# Altium schematic sheet PowerManagement.SchDoc
size 420 x 297 mm; Dosya adı / File Name: Power Management; Tanım / Description: Wireless Security Detector; Hazırlayan / Prepared By: MFY; Kontrol eden / Checked by: MFY; Onaylayan  /Approved by: MFY; Bölüm / Department: R&D - ARGE; Yayın Tarihi / Rel.date: 11.08.2025; Değ. tarihi / change date: 11.08.2025; Revizyon / Revision: AA; Size: A3
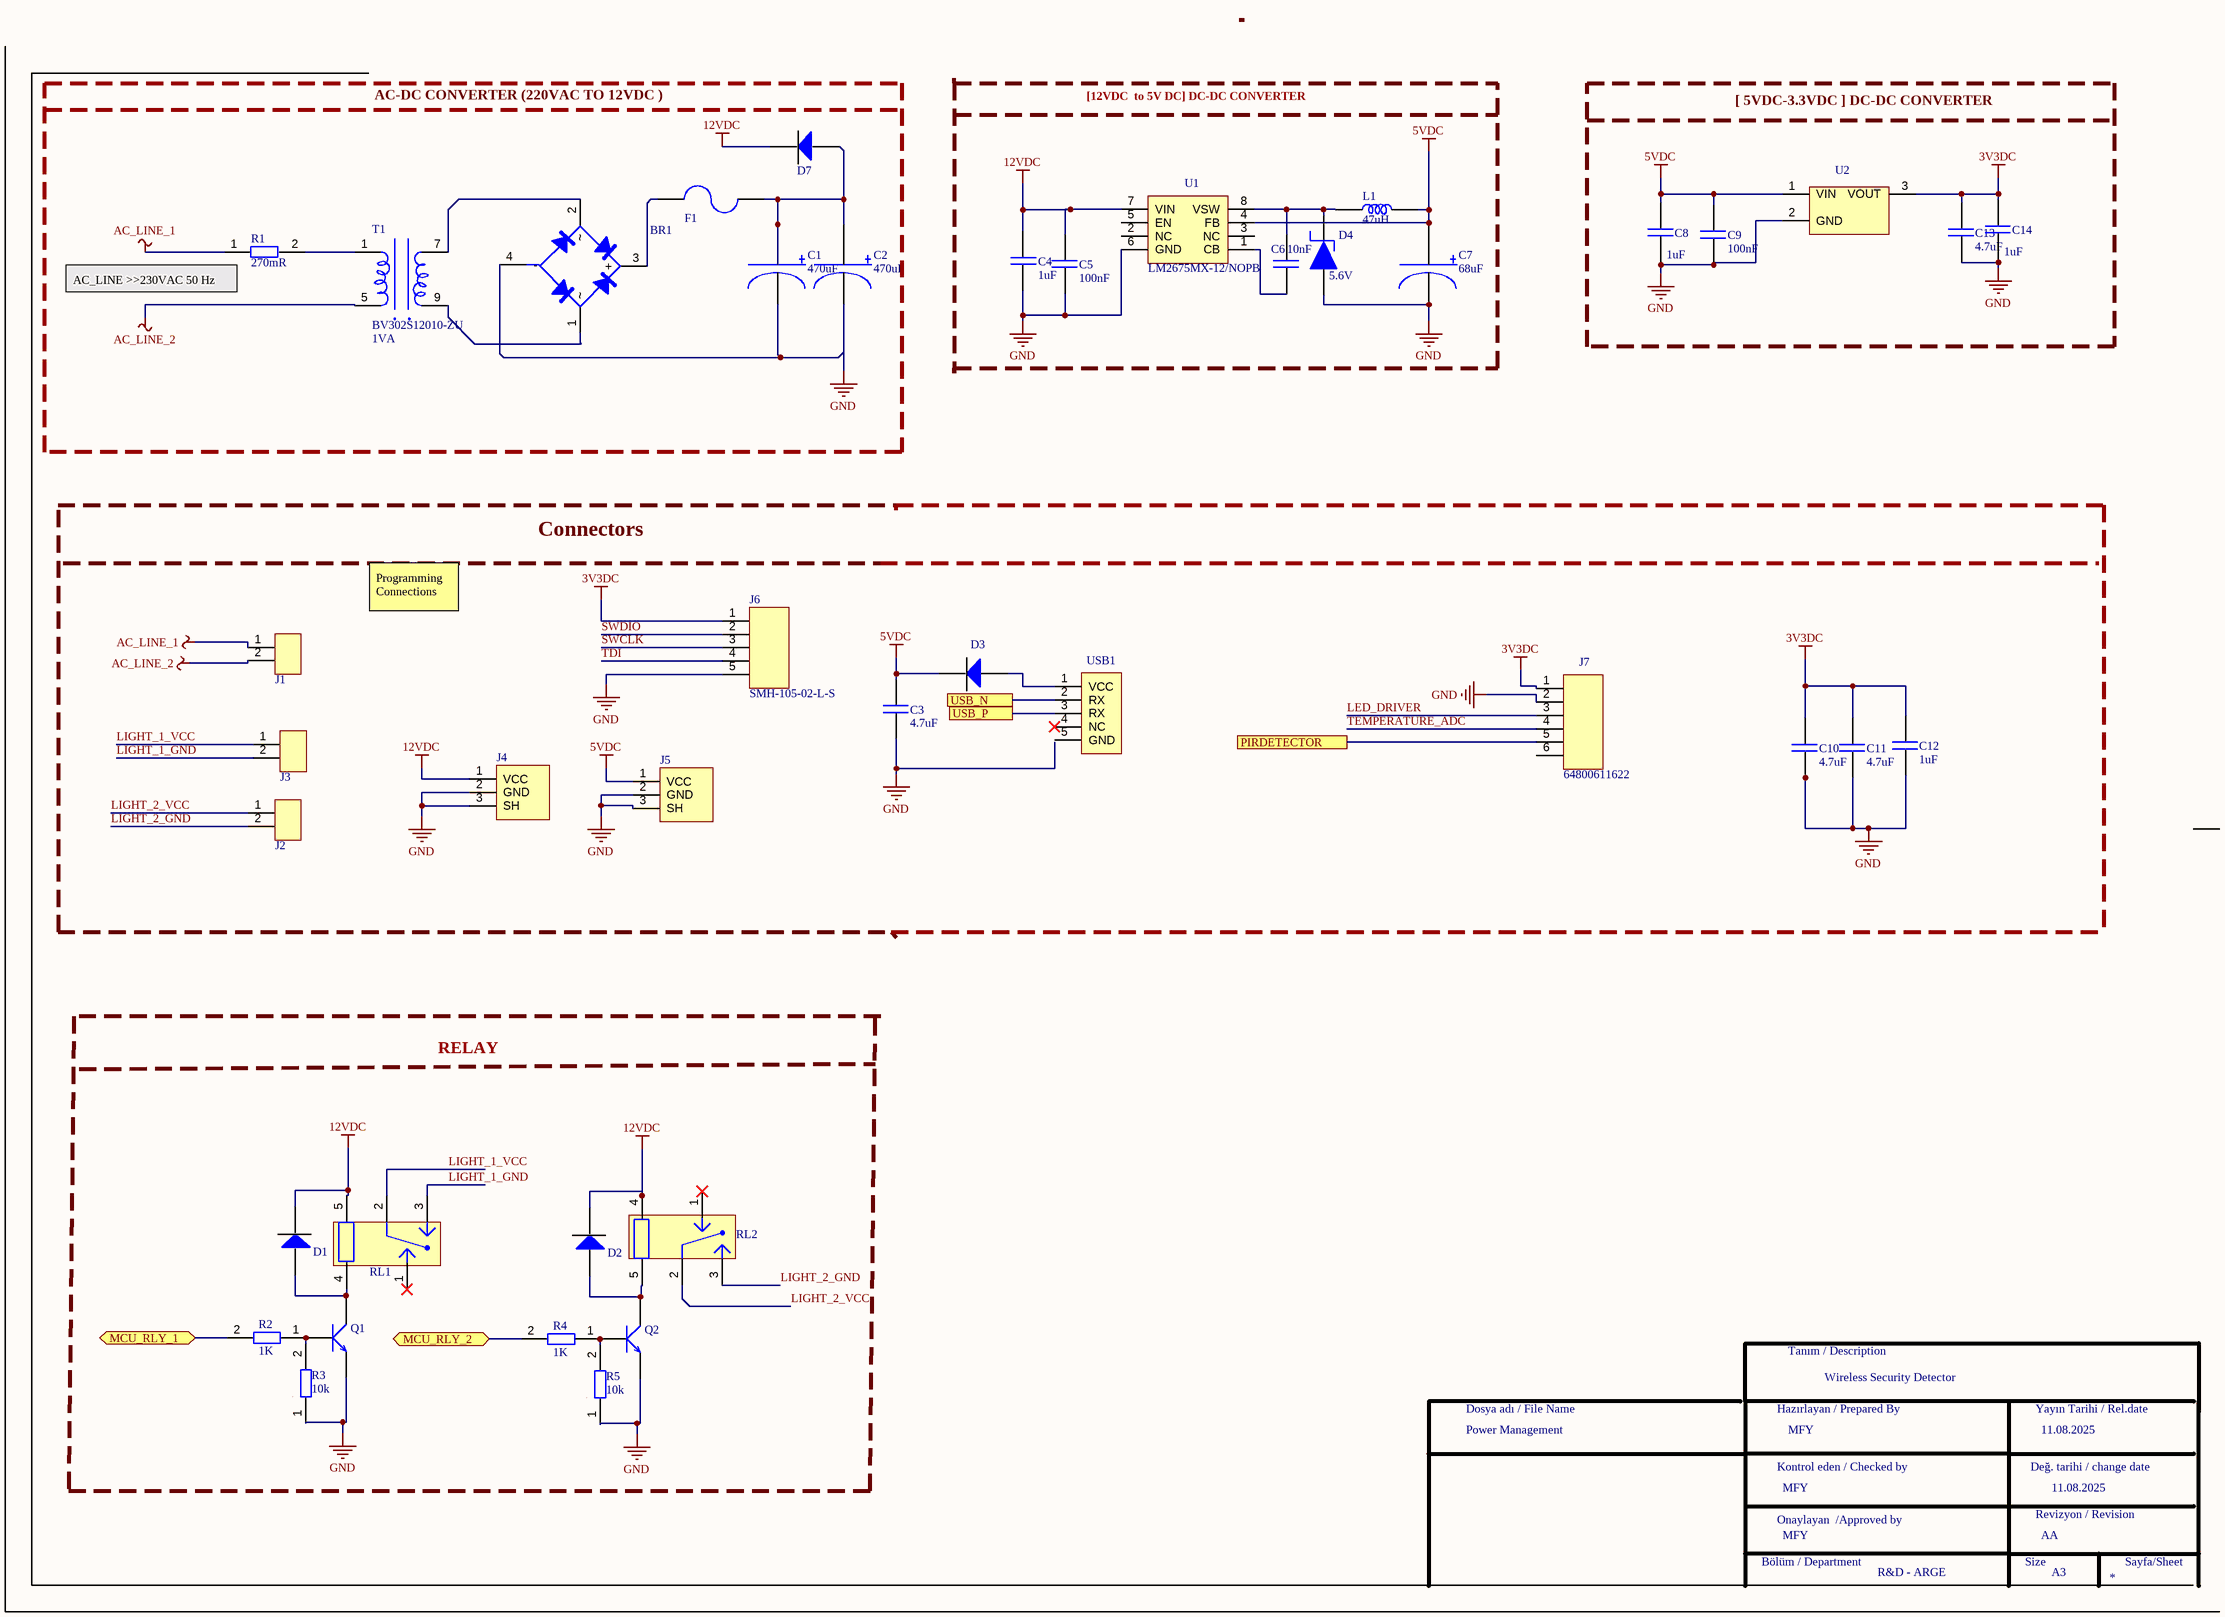
[diagram p0: PowerManagement.SchDoc]

## Parts
BR1  DB105STR  [DB105STR]  (value not drawn)
C1  value 470uF  [CAP_RADIAL_D10_P5]  (hidden comment: ESH477M050AH4AA)
C2  value 470uF  [CAP_RADIAL_D10_P5]  (hidden comment: ESH477M050AH4AA)
C3  value 4.7uF  [CAP_0805]  (hidden comment: CL21A475KAQNNNE)
C4  value 1uF  [CAP_0805]  (hidden comment: CL21B105KBFNNNE)
C5  value 100nF  [CAP_0805]  (hidden comment: CL21B104KBCNNNC)
C6  value 10nF  [CAP_0603]  (hidden comment: 0603B103K160CT)
C7  value 68uF  [CAP_EEVseries]  (hidden comment: EEV686M035A9HAA)
C8  value 1uF  [CAP_0805]  (hidden comment: CL21B105KBFNNNE)
C9  value 100nF  [CAP_0603]  (hidden comment: CAP CER 100nF 0603)
C10  value 4.7uF  [CAP_0805]  (hidden comment: CL21A475KAQNNNE)
C11  value 4.7uF  [CAP_0805]  (hidden comment: CL21A475KAQNNNE)
C12  value 1uF  [CAP_0805]  (hidden comment: CL21B105KBFNNNE)
C13  value 4.7uF  [CAP_0805]  (hidden comment: CL21A475KAQNNNE)
C14  value 1uF  [CAP_0805]  (hidden comment: CL21B105KBFNNNE)
D1  1N4148WS  [SOD323F]  (value not drawn)
D2  1N4148WS  [SOD323F]  (value not drawn)
D3  1N4148WS  [SOD323F]  (value not drawn)
D4  Working Voltage: 5.6V  [SMB]  (hidden comment: 1SMB5919BT3G)
D7  1N4148WS  [SOD323F]  (value not drawn)
F1  FUSE 3413.0216.22  [3413.0216.22]  (value not drawn)
J1  TBP01R1-508-02BE  [TBP01R1-508]  (value not drawn)
J2  TBP01R1-508-02BE  [TBP01R1-508]  (value not drawn)
J3  TBP01R1-508-02BE  [TBP01R1-508]  (value not drawn)
J4  PJ-037AH-SMT-TR  [JACK]  (value not drawn)
J5  PJ-037AH-SMT-TR  [JACK]  (value not drawn)
J6  SMH-105-02-L-S  [PIN_Headers1x5RA]
J7  64800611622  [64800611622_WÜRTH_CONN]
L1  value 47uH  [IND_1212]  (hidden comment: 78438335470)
Q1  MMBT3904-7-F  [SOT23-F]  (value not drawn)
Q2  MMBT3904-7-F  [SOT23-F]  (value not drawn)
R1  value 270mR  [RES_AXIAL_W]  (hidden comment: 5WD27)
R2  value 1K  [RES_0603]  (hidden comment: RES 1K OHM 0603)
R3  value 10k  [RES_0603]  (hidden comment: RC0603FR-0710KL)
R4  value 1K  [RES_0603]  (hidden comment: RES 1K OHM 0603)
R5  value 10k  [RES_0603]  (hidden comment: RC0603FR-0710KL)
RL1  ALQ112  [ALQ112]  (value not drawn)
RL2  ALQ112  [ALQ112]  (value not drawn)
T1  BV302S12010-ZU  Rated Power: 1VA  [BV302S]
U1  LM2675MX-12/NOPB  [SOIC8]
U2  AP7361-33E-13  [SOT-223]  (value not drawn)
USB1  10118192-0001LF  [MICRO_B_USB]  (value not drawn)

## Blocks framed on the sheet
AC-DC CONVERTER (220VAC TO 12VDC ): BR1 C1 C2 D7 F1 R1 T1
[ 5VDC-3.3VDC ] DC-DC CONVERTER: C8 C9 C13 C14 U2

## Ports
MCU_RLY_1 (bidir, see Microcontroller[4C]), MCU_RLY_2 (bidir, see Microcontroller[4C]), PIRDETECTOR (see Microcontroller[4C]), USB_N (see Microcontroller[5B]), USB_P (see Microcontroller[5B])

## Nets
3V3DC: C10.2 C11.2 C12.2 C13.2 C14.2 J6.1 J7.1(VCC) U2.3(VOUT)
5VDC: C3.2 C7.1 C8.2 C9.2 D3.1 J5.1(VCC) L1.2 U1.4(FB) U2.1(VIN)
12VDC: C4.1 C5.2 D1.1 D2.1 D7.1 J4.1(VCC) RL1.5 RL2.4 U1.7(VIN)
AC_LINE_1: J1.1 R1.1
AC_LINE_2: J1.2 T1.5
GND: BR1.4(-) C1.2 C2.2 C3.1 C4.2 C5.1 C7.2 C8.1 C9.1 C10.1 C11.1 C12.1 C13.1 C14.1 D4.A J4.2(GND) J4.3(SH) J5.2(GND) J5.3(SH) J6.5 J7.2(RX) Q1.2(E) Q2.2(E) R3.1 R5.1 U1.6(GND) U2.2(GND)
LED_DRIVER: J7.3(RX)
LIGHT_1_GND: J3.2 RL1.3
LIGHT_1_VCC: J3.1 RL1.2
LIGHT_2_GND: J2.2 RL2.3
LIGHT_2_VCC: J2.1 RL2.2
MCU_RLY_1: R2.2 ; port MCU_RLY_1
MCU_RLY_2: R4.2 ; port MCU_RLY_2
PIRDETECTOR: J7.5(GND) ; port PIRDETECTOR
SWCLK: J6.3
SWDIO: J6.2
TDI: J6.4
TEMPERATURE_ADC: J7.4(NC)
USB_N: USB1.2(RX) ; port USB_N
USB_P: USB1.3(RX) ; port USB_P
NetBR1_1: BR1.1 T1.9
NetBR1_2: BR1.2 T1.7
NetBR1_3: BR1.3(+) F1.1(G)
NetC1_1: C1.1 C2.1 D7.2 F1.2
NetC6_1: C6.1 U1.1(CB)
NetC6_2: C6.2 D4.C L1.1 U1.8(VSW)
NetD1_2: D1.2 Q1.3(C) RL1.4
NetD2_2: D2.2 Q2.3(C) RL2.5
NetD3_2: D3.2 USB1.1(VCC)
NetQ1_1: Q1.1(B) R2.1 R3.2
NetQ2_1: Q2.1(B) R4.1 R5.2
NetR1_2: R1.2 T1.1

Not connected (* = marked no-connect by the designer): J7 6(GND); RL1 1*; RL2 1*; U1 2(NC) 3(NC) 5(EN); USB1 4(NC)* 5(GND)

## Notes on the sheet
- [12VDC  to 5V DC] DC-DC CONVERTER
- (near R1) AC_LINE >>230VAC 50 Hz
- Connectors
- Programming Connections
- RELAY
- Tanım / Description
- Dosya adı / File Name
- Hazırlayan / Prepared By
- Yayın Tarihi / Rel.date
- Kontrol eden / Checked by
- Değ. tarihi / change date
- Bölüm / Department
- Onaylayan  /Approved by
- Size
- Revizyon / Revision
- Sayfa/Sheet

## Library data of the parts
BR1 = DB105STR: Bridge Rect 1PHASE 600V 1A Db-s; Manufacturer: SMC; Supplier: Future Electronics; Supplier Part Number: 5119461; Manufacturer Part Number: DB105STR; RoHS: No; Category: Industrial Control; Pricing: 1500=0,0543, 4500=0,0528, 7500=0,0522, 15000=0,0513, 30000=0,0499 (USD); ComponentLink1URL: http://www.smc-diodes.com/propdf/DB101S%20THRU%20DB107S%20N1459%20REV.B.pdf?src-supplier=Digikey; ComponentLink1Description: http://www.smc-diodes.com/propdf/DB101S%20THRU%20DB107S%20N1459%20REV.B.pdf?src-supplier=Digikey; Operating Voltage: 600V; Max Current: 1A; Case/Package: DB-S
C1 C2 = CAP ALU ELEC 470uF 50V: Aluminum Electrolytic Capacitor, Polarized, Aluminum (wet), 50V, 20% +Tol, 20% -Tol, 470uF, Through Hole Mount; Manufacturer: KEMET; Dielectric Material: Aluminium; Leakage Current: 235uA; Ripple Current: 630mA; Tan Delta: 0.12; Supplier: Mouser; Supplier Part Number: 80-ESH477M050AH4AA; Manufacturer Part Number: ESH477M050AH4AA; RoHS: Yes; Category: Capacitors; Stock: 31; Pricing: 1=0,55, 10=0,338, 50=0,338, 100=0,251, 1000=0,206, 10000=0,174 (USD); Mounting Technology: Through Hole; Pins: 2; Package Shape: Cylindrical; Min Operating Temperature: -40°C; Max Operating Temperature: 105°C; Polarity: Polarized; Capacitor Type: Aluminium; Tolerance  (fill in as +-): 20%; Packaging: Bulk; Tolerance (fill in as +-): 20%; Rated DC Voltage (URdc): 50V; Termination: Wire; Reach SVHC Compliant: Yes; RoHS Compliant: Yes; ComponentLink1URL: https://datasheet.ciiva.com:443/pdfs/VipMasterIC/IC/KEME/KEME-S-A0008512286/KEME-S-A0008512286-1.pdf?src-supplier=IHS+Markit; ComponentLink1Description: https://datasheet.ciiva.com:443/pdfs/VipMasterIC/IC/KEME/KEME-S-A0008512286/KEME-S-A0008512286-1.pdf?src-supplier=IHS+Markit; ComponentLink2URL: https://api.kemet.com/component-edge/download/datasheet/ESH477M050AH4AA.pdf?src-supplier=Digikey; ComponentLink2Description: https://api.kemet.com/component-edge/download/datasheet/ESH477M050AH4AA.pdf?src-supplier=Digikey; ComponentLink3URL: https://datasheet.octopart.com/ESH477M050AH4AA-KEMET-datasheet-130075338.pdf?src-supplier=Newark; ComponentLink3Description: https://datasheet.octopart.com/ESH477M050AH4AA-KEMET-datasheet-130075338.pdf?src-supplier=Newark; ComponentLink4URL: https://datasheet.octopart.com/ESH477M050AH4AA-KEMET-datasheet-157246171.pdf?src-supplier=Element14; ComponentLink4Description: https://datasheet.octopart.com/ESH477M050AH4AA-KEMET-datasheet-157246171.pdf?src-supplier=Element14
C3 C10 C11 C13 = CAP CER 4.7uF 0805: Ceramic Capacitor, Multilayer, Ceramic, 25V, 10% +Tol, 10% -Tol, X5R, 15% TC, 4.7uF, Surface Mount, 0805; Manufacturer: Samsung; Multilayer: Yes; Supplier: Mouser; Supplier Part Number: 187-CL21A475KAQNNNE; Manufacturer Part Number: CL21A475KAQNNNE; RoHS: Yes; Category: Ceramic Capacitors; Stock: 101326; Pricing: 1=0,1, 10=0,039, 50=0,039, 100=0,032, 1000=0,022, 10000=0,012 (USD); Mounting Technology: Surface Mount; Pins: 2; Dielectric Material: Ceramic; Package Shape: Rectangular; Case/Package: 0805; Terminal Finish: Nickel; Min Operating Temperature: -55°C; Max Operating Temperature: 85°C; JESD-609 Code: e3; Capacitor Type: Ceramic; Tolerance  (fill in as +-): 10%; Package Style: SMTMeter; Packaging: Tape and Reel; Tolerance (fill in as +-): 10%; Rated DC Voltage (URdc): 25V; Temperature Characteristics Code: X5R; Termination: Wraparound; Length: 2mm; Width: 1.25mm; Height: 1.4mm; Reach SVHC Compliant: Yes; RoHS Compliant: Yes; ComponentLink1URL: https://datasheet.ciiva.com:443/pdfs/VipMasterIC/IC/SEMS/SEMS-S-A0008528919/SEMS-S-A0008528938-1.pdf?src-supplier=IHS+Markit; ComponentLink1Description: https://datasheet.ciiva.com:443/pdfs/VipMasterIC/IC/SEMS/SEMS-S-A0008528919/SEMS-S-A0008528938-1.pdf?src-supplier=IHS+Markit; ComponentLink2URL: https://datasheet.ciiva.com/25798/cl21a475kaqnnne-25798882.pdf?src-supplier=Digikey; ComponentLink2Description: https://datasheet.ciiva.com/25798/cl21a475kaqnnne-25798882.pdf?src-supplier=Digikey
C4 C8 C12 C14 = CAP CER 1uF 0805: Ceramic Capacitor, Multilayer, Ceramic, 50V, 10% +Tol, 10% -Tol, X7R, 15% TC, 1uF, Surface Mount, 0805; Manufacturer: Samsung; Multilayer: Yes; Supplier: Mouser; Supplier Part Number: 187-CL21B105KBFNNNE; Manufacturer Part Number: CL21B105KBFNNNE; RoHS: Yes; Category: Ceramic Capacitors; Stock: 619004; Pricing: 1=0,1, 10=0,016, 50=0,016, 100=0,013, 1000=0,013, 10000=0,011 (USD); Mounting Technology: Surface Mount; Pins: 2; Dielectric Material: Ceramic; Package Shape: Rectangular; Case/Package: 0805; Terminal Finish: Nickel; Min Operating Temperature: -55°C; Max Operating Temperature: 125°C; JESD-609 Code: e3; Capacitor Type: Ceramic; Tolerance  (fill in as +-): 10%; Package Style: SMTMeter; Packaging: Tape and Reel; Tolerance (fill in as +-): 10%; Rated DC Voltage (URdc): 50V; Temperature Characteristics Code: X7R; Termination: Wraparound; Length: 2mm; Width: 1.25mm; Height: 1.35mm; Reach SVHC Compliant: Yes; RoHS Compliant: Yes; ComponentLink1URL: https://datasheet.ciiva.com:443/pdfs/VipMasterIC/IC/SEMS/SEMS-S-A0008524728/SEMS-S-A0008523023-1.pdf?src-supplier=IHS+Markit; ComponentLink1Description: https://datasheet.ciiva.com:443/pdfs/VipMasterIC/IC/SEMS/SEMS-S-A0008524728/SEMS-S-A0008523023-1.pdf?src-supplier=IHS+Markit; ComponentLink2URL: https://datasheet.ciiva.com/16449/cl21b105kbfnnne-16449003.pdf?src-supplier=Future+Electronics; ComponentLink2Description: https://datasheet.ciiva.com/16449/cl21b105kbfnnne-16449003.pdf?src-supplier=Future+Electronics; ComponentLink3URL: https://datasheet.ciiva.com/25800/cl21b105kbfnnne-25800291.pdf?src-supplier=Digikey; ComponentLink3Description: https://datasheet.ciiva.com/25800/cl21b105kbfnnne-25800291.pdf?src-supplier=Digikey
C5 = CAP CER 100nF 0805: Ceramic Capacitor, Multilayer, Ceramic, 50V, 10% +Tol, 10% -Tol, X7R, 15% TC, 0.1uF, Surface Mount, 0805; Manufacturer: Samsung; Multilayer: Yes; Supplier: Mouser; Supplier Part Number: 187-CL21B104KBCNNNC; Manufacturer Part Number: CL21B104KBCNNNC; RoHS: Yes; Category: Ceramic Capacitors; Stock: 699327; Pricing: 1=0,1, 10=0,006, 50=0,006, 100=0,006, 1000=0,006, 10000=0,005 (USD); Mounting Technology: Surface Mount; Pins: 2; Dielectric Material: Ceramic; Package Shape: Rectangular; Case/Package: 0805; Terminal Finish: Nickel; Min Operating Temperature: -55°C; Max Operating Temperature: 125°C; JESD-609 Code: e3; Capacitor Type: Ceramic; Tolerance  (fill in as +-): 10%; Package Style: SMTMeter; Packaging: Tape and Reel; Tolerance (fill in as +-): 10%; Rated DC Voltage (URdc): 50V; Temperature Characteristics Code: X7R; Termination: Wraparound; Length: 2mm; Width: 1.25mm; Height: 0.95mm; Reach SVHC Compliant: Yes; RoHS Compliant: Yes; ComponentLink1URL: https://datasheet.ciiva.com:443/pdfs/VipMasterIC/IC/SEMS/SEMS-S-A0008521003/SEMS-S-A0008521039-1.pdf?src-supplier=IHS+Markit; ComponentLink1Description: https://datasheet.ciiva.com:443/pdfs/VipMasterIC/IC/SEMS/SEMS-S-A0008521003/SEMS-S-A0008521039-1.pdf?src-supplier=IHS+Markit; ComponentLink2URL: https://datasheet.ciiva.com/25710/cl21b104kbcnnnc-25710182.pdf?src-supplier=Digikey; ComponentLink2Description: https://datasheet.ciiva.com/25710/cl21b104kbcnnnc-25710182.pdf?src-supplier=Digikey; ComponentLink3URL: https://datasheet.ciiva.com/29199/454152-da-01-en-vs-kondensator-0805-29199814.pdf?src-supplier=Conrad; ComponentLink3Description: https://datasheet.ciiva.com/29199/454152-da-01-en-vs-kondensator-0805-29199814.pdf?src-supplier=Conrad
C6 = CAP CER 10nF 0603: Ceramic Capacitor, Multilayer, Ceramic, 16V, 10% +Tol, 10% -Tol, X7R, 15% TC, 0.01uF, Surface Mount, 0603; Manufacturer: Walsin Technologies; Multilayer: Yes; Supplier: Mouser; Supplier Part Number: 791-0603B103K160CT; Manufacturer Part Number: 0603B103K160CT; RoHS: Yes; Category: Ceramic Capacitors; Stock: 5599; Pricing: 1=0,1, 10=0,017, 50=0,017, 100=0,01, 1000=0,006, 10000=0,003 (USD); Mounting Technology: Surface Mount; Pins: 2; Dielectric Material: Ceramic; Case/Package: 0603; Package Shape: Rectangular; Terminal Finish: Nickel; Min Operating Temperature: -55°C; Max Operating Temperature: 125°C; Capacitor Type: Ceramic; Tolerance  (fill in as +-): 10%; Package Style: SMTMeter; Packaging: Tape and Reel; Tolerance (fill in as +-): 10%; Rated DC Voltage (URdc): 16V; Temperature Characteristics Code: X7R; JESD-609 Code: e3; Termination: Wraparound; Length: 1.6mm; Width: 0.8mm; Height: 0.8mm; Reach SVHC Compliant: Yes; RoHS Compliant: Yes; ComponentLink1URL: https://datasheet.ciiva.com:443/pdfs/VipMasterIC/IC/WATC/WATC-S-A0009550342/WATC-S-A0009550342-1.pdf?src-supplier=IHS+Markit; ComponentLink1Description: https://datasheet.ciiva.com:443/pdfs/VipMasterIC/IC/WATC/WATC-S-A0009550342/WATC-S-A0009550342-1.pdf?src-supplier=IHS+Markit; ComponentLink2URL: http://www.farnell.com/datasheets/1958513.pdf?src-supplier=Farnell; ComponentLink2Description: http://www.farnell.com/datasheets/1958513.pdf?src-supplier=Farnell; ComponentLink3URL: https://datasheet.octopart.com/0603B103K160CT-Walsin-Technologies-datasheet-85392065.pdf?src-supplier=Element14; ComponentLink3Description: https://datasheet.octopart.com/0603B103K160CT-Walsin-Technologies-datasheet-85392065.pdf?src-supplier=Element14; ComponentLink4URL: http://www.passivecomponent.com/wp-content/uploads/2018/10/MLCC.pdf?src-supplier=Digikey; ComponentLink4Description: http://www.passivecomponent.com/wp-content/uploads/2018/10/MLCC.pdf?src-supplier=Digikey; ComponentLink5URL: https://datasheet.octopart.com/0603B103K160CT-Walsin-Technologies-datasheet-136037192.pdf?src-supplier=Future+Electronics; ComponentLink5Description: https://datasheet.octopart.com/0603B103K160CT-Walsin-Technologies-datasheet-136037192.pdf?src-supplier=Future+Electronics; ComponentLink6URL: https://datasheet.octopart.com/0603B103K160CT-Walsin-Technologies-datasheet-62066062.pdf?src-supplier=TME; ComponentLink6Description: https://datasheet.octopart.com/0603B103K160CT-Walsin-Technologies-datasheet-62066062.pdf?src-supplier=TME
C7 = CAP ALU 68uF: Aluminum Electrolytic Capacitor, Polarized, Aluminum (wet), 35V, 20% +Tol, 20% -Tol, 68uF, Surface Mount, 2626; Manufacturer: KEMET; Dielectric Material: Aluminium; ESR (Equivalent Series Resistance): 340mR; Leakage Current: 23.8uA; Ripple Current: 196mA; Tan Delta: 0.12; Supplier: Mouser; Supplier Part Number: 80-EEV686M035A9HAA; Manufacturer Part Number: EEV686M035A9HAA; RoHS: Yes; Category: Aluminum Electrolytic Capacitors; Stock: 1319; Pricing: 1=0,63, 10=0,35, 50=0,35, 100=0,266, 1000=0,166, 10000=0,166 (USD); Mounting Technology: Surface Mount; Pins: 2; Package Shape: Cylindrical; Case/Package: 2626; Min Operating Temperature: -55°C; Max Operating Temperature: 105°C; Polarity: Polarized; Capacitor Type: Aluminium; Tolerance  (fill in as +-): 20%; Package Style: SMTMeter; Packaging: Tape and Reel; Tolerance (fill in as +-): 20%; Rated DC Voltage (URdc): 35V; Termination: Flat; Length: 7.8mm; Width: 6.6mm; Height: 7.7mm; Reach SVHC Compliant: Yes; RoHS Compliant: Yes; ComponentLink1URL: https://datasheet.ciiva.com:443/pdfs/VipMasterIC/IC/KEME/KEME-S-A0008611149/KEME-S-A0008611149-1.pdf?src-supplier=IHS+Markit; ComponentLink1Description: https://datasheet.ciiva.com:443/pdfs/VipMasterIC/IC/KEME/KEME-S-A0008611149/KEME-S-A0008611149-1.pdf?src-supplier=IHS+Markit; ComponentLink2URL: https://datasheet.ciiva.com/5365/kem-a4002-eev-535332-5365784.pdf?src-supplier=Mouser; ComponentLink2Description: https://datasheet.ciiva.com/5365/kem-a4002-eev-535332-5365784.pdf?src-supplier=Mouser
C9 = CAP CER 100nF 0603: CAP CER %10 100 nF 0603 Kemet; Manufacturer Part Number: C0603C104K5RACTU; Dielectric Material: Ceramic; Multilayer: Yes; Tolerance  (fill in as +-): 10%; Rated DC Voltage (URdc): 50V; Temperature Characteristics Code: X7R; Supplier: Mouser; Supplier Part Number: 80-C0603C104K5R; Manufacturer: KEMET; RoHS: Yes; Category: Ceramic Capacitors; Stock: 2298151; Pricing: 1=0,1, 10=0,012, 50=0,012, 100=0,011, 1000=0,011, 10000=0,01 (USD); Mounting Technology: Surface Mount; Pins: 2; Package Shape: Rectangular; Case/Package: 0603; Terminal Finish: Nickel; Min Operating Temperature: -55°C; Max Operating Temperature: 125°C; JESD-609 Code: e3; Capacitor Type: Ceramic; Package Style: SMTMeter; Packaging: Tape and Reel; Tolerance (fill in as +-): 10%; Termination: Wraparound; Length: 1.6mm; Width: 0.8mm; Height: 0.8mm; Reach SVHC Compliant: Yes; RoHS Compliant: Yes; ComponentLink1URL: https://datasheet.ciiva.com:443/pdfs/VipMasterIC/IC/KEME/KEME-S-A0008991654/KEME-S-A0008991654-1.pdf?src-supplier=IHS+Markit; ComponentLink1Description: https://datasheet.ciiva.com:443/pdfs/VipMasterIC/IC/KEME/KEME-S-A0008991654/KEME-S-A0008991654-1.pdf?src-supplier=IHS+Markit; ComponentLink2URL: https://datasheet.ciiva.com/7823/kem-c1002-x7r-smd-7823592.pdf?src-supplier=Element14; ComponentLink2Description: https://datasheet.ciiva.com/7823/kem-c1002-x7r-smd-7823592.pdf?src-supplier=Element14; ComponentLink3URL: https://datasheet.ciiva.com/28645/1851736-28645640.pdf?src-supplier=Element14; ComponentLink3Description: https://datasheet.ciiva.com/28645/1851736-28645640.pdf?src-supplier=Element14; ComponentLink4URL: https://datasheet.ciiva.com/14602/70095383-14602583.pdf?src-supplier=Allied+Electronics; ComponentLink4Description: https://datasheet.ciiva.com/14602/70095383-14602583.pdf?src-supplier=Allied+Electronics; ComponentLink5URL: https://datasheet.ciiva.com/7823/kem-c1002-x7r-smd-7823591.pdf?src-supplier=Element14; ComponentLink5Description: https://datasheet.ciiva.com/7823/kem-c1002-x7r-smd-7823591.pdf?src-supplier=Element14; ComponentLink6URL: https://datasheet.ciiva.com/5999/kem-c1002-x7r-smd-5999400.pdf?src-supplier=Farnell; ComponentLink6Description: https://datasheet.ciiva.com/5999/kem-c1002-x7r-smd-5999400.pdf?src-supplier=Farnell; ComponentLink7URL: https://datasheet.ciiva.com/14585/70095383-14585209.pdf?src-supplier=Allied+Electronics; ComponentLink7Description: https://datasheet.ciiva.com/14585/70095383-14585209.pdf?src-supplier=Allied+Electronics
D1-D3 D7 = 1N4148WS: Rectifier Diode, 1 Phase, 1 Element, 0.15A, 100V V(RRM), Silicon; Manufacturer: onsemi; Package Body Material: Plastic; Number of Elements: 1; Max Output current: 150mA; Reverse Recovery Time-Max: 0.004us; Qualification Status: Not Qualified; Forward Voltage: 1V; Supplier: Mouser; Supplier Part Number: 512-1N4148WS; Manufacturer Part Number: 1N4148WS; RoHS: Yes; Category: Rectifier Diodes; Stock: 898084; Pricing: 1=0,11, 10=0,066, 50=0,066, 100=0,062, 1000=0,041, 10000=0,019 (USD); Pins: 2; Diode Element Material: SILICON; Package Shape: Rectangular; Max Operating Temperature: 150°C; Diode Type: RECTIFIER; JESD-30 Code: R-PDSO-F2; Package Style: SMALL OUTLINEMeter; Rep Pk Reverse Voltage-Max: 100V; Surface Mount: Yes; Terminal Form: Flat; Terminal Position: DUAL; Moisture Sensitivity Level: 1; Reach SVHC Compliant: Yes; RoHS Compliant: Yes; ComponentLink1URL: https://datasheet.ciiva.com:443/pdfs/VipMasterIC/IC/ONSM/ONSM-S-A0003392874/ONSM-S-A0003585195-1.pdf?src-supplier=IHS+Markit; ComponentLink1Description: https://datasheet.ciiva.com:443/pdfs/VipMasterIC/IC/ONSM/ONSM-S-A0003392874/ONSM-S-A0003585195-1.pdf?src-supplier=IHS+Markit
D4 = 1SMB5919BT3G: Zener Diode 5.6 V 3 W ±5% Surface Mount SMB; DESINED BY: MFY
F1 = FUSE 3413.0216.22: Electric Fuse, Very Fast Blow, 1A, 32VAC, 63VDC, 63A (IR), Surface Mount, 1206; Manufacturer: Schurter; Joule-integral-Nom: 0.2J; Pre-arcing time-Min: 1ms; Voltage Rating: 32V; Body Breadth: 1.6mm; Body Height: 0.6mm; Body Length or Diameter: 3.2mm; Reference Standard: UL; Supplier: Mouser; Supplier Part Number: 693-3413.0216.22; Manufacturer Part Number: 3413.0216.22; RoHS: Yes; Category: Fuses; Stock: 2978; Pricing: 1=0,56, 10=0,558, 50=0,448, 100=0,413, 1000=0,412, 10000=0,386 (USD); Mounting Technology: Surface Mount; Terminal Finish: Nickel; Min Operating Temperature: -55°C; Max Operating Temperature: 90°C; JESD-609 Code: e4; Blow Characteristic: VERY FAST; Circuit Protection Type: Electric Fuse; Packaging: Tape and Reel; Rated Breaking Capacity: 63A; Current Rating: 1A; Termination: Wraparound; Reach SVHC Compliant: Yes; RoHS Compliant: Yes; ComponentLink1URL: https://datasheet.ciiva.com:443/pdfs/VipMasterIC/IC/SHRI/SHRI-S-A0004985783/SHRI-S-A0004985783-1.pdf?src-supplier=IHS+Markit; ComponentLink1Description: https://datasheet.ciiva.com:443/pdfs/VipMasterIC/IC/SHRI/SHRI-S-A0004985783/SHRI-S-A0004985783-1.pdf?src-supplier=IHS+Markit; ComponentLink2URL: https://datasheet.ciiva.com/301/typ-usi-1206-301440.pdf?src-supplier=Digikey; ComponentLink2Description: https://datasheet.ciiva.com/301/typ-usi-1206-301440.pdf?src-supplier=Digikey; ComponentLink3URL: https://datasheet.ciiva.com/14102/qousi1206-data-e-14102903.pdf?src-supplier=Distrelec; ComponentLink3Description: https://datasheet.ciiva.com/14102/qousi1206-data-e-14102903.pdf?src-supplier=Distrelec; ComponentLink4URL: https://datasheet.ciiva.com/8264/typ-usi-1206-8264583.pdf?src-supplier=Avnet; ComponentLink4Description: https://datasheet.ciiva.com/8264/typ-usi-1206-8264583.pdf?src-supplier=Avnet; ComponentLink5URL: https://datasheet.ciiva.com/16316/typ-usi-1206-16316588.pdf?src-supplier=Future+Electronics; ComponentLink5Description: https://datasheet.ciiva.com/16316/typ-usi-1206-16316588.pdf?src-supplier=Future+Electronics; ComponentLink6URL: https://datasheet.ciiva.com/301/typ-usi-1206-301439.pdf?src-supplier=Digikey; ComponentLink6Description: https://datasheet.ciiva.com/301/typ-usi-1206-301439.pdf?src-supplier=Digikey; ComponentLink7URL: https://datasheet.ciiva.com/301/typ-usi-1206-301441.pdf?src-supplier=Digikey; ComponentLink7Description: https://datasheet.ciiva.com/301/typ-usi-1206-301441.pdf?src-supplier=Digikey; ComponentLink8URL: https://datasheet.ciiva.com/14541/70160006-14541114.pdf?src-supplier=Allied+Electronics; ComponentLink8Description: https://datasheet.ciiva.com/14541/70160006-14541114.pdf?src-supplier=Allied+Electronics
J1-J3 = TBP01R1-508-02BE: Strip Terminal Block; Manufacturer: Same Sky; DESIGNED BY: MFY; Supplier: Arrow Electronics; Supplier Part Number: TBP01R1-508-02BE; Manufacturer Part Number: TBP01R1-508-02BE; RoHS: Yes; Category: Terminal Blocks; Stock: 3065; Pricing: 1=0,0786 (USD); ComponentLink1URL: https://www.cuidevices.com/product/resource/digikeypdf/tbp01r1-508.pdf?src-supplier=Digikey; ComponentLink1Description: https://www.cuidevices.com/product/resource/digikeypdf/tbp01r1-508.pdf?src-supplier=Digikey; ComponentLink2URL: https://datasheet.octopart.com/TBP01R1-508-02BE-Same-Sky-datasheet-182050293.pdf?src-supplier=Future+Electronics; ComponentLink2Description: https://datasheet.octopart.com/TBP01R1-508-02BE-Same-Sky-datasheet-182050293.pdf?src-supplier=Future+Electronics; ComponentLink3URL: https://datasheet.octopart.com/TBP01R1-508-02BE-Same-Sky-datasheet-182881516.pdf?src-supplier=Electro+Sonic; ComponentLink3Description: https://datasheet.octopart.com/TBP01R1-508-02BE-Same-Sky-datasheet-182881516.pdf?src-supplier=Electro+Sonic; ComponentLink4URL: https://datasheet.octopart.com/TBP01R1-508-02BE-Same-Sky-datasheet-189105742.pdf?src-supplier=Master+Electronics; ComponentLink4Description: https://datasheet.octopart.com/TBP01R1-508-02BE-Same-Sky-datasheet-189105742.pdf?src-supplier=Master+Electronics
J4 J5 = PJ-037AH-SMT-TR: Power Barrel Connector Jack 2.10mm ID (0.083"), 5.50mm OD (0.217") Surface Mount, Right Angle; Through Hole; DESIGNED BY: MFY
J6 = SMH-105-02-L-S: Board Connector, 5 Contact(s), 1 Row(s), Female, Right Angle, 0.1 inch Pitch, Surface Mount Terminal, Locking, Black Insulator, Socket; Manufacturer: Samtec; Contact Pattern: RECTANGULAR; Contact Style: SQ PIN-SKT; Number Of Connectors: 1; Polarization Key: POLARIZED HOUSING; Number of Contacts: 5; Option: General Purpose; Filter Feature: No; Mating Information: MULTIPLE MATING PARTS AVAILABLE; Body Breadth: 0.095inch; Body Depth: 0.47inch; Body Length: 0.52inch; Plating Thickness: 10uin; Reference Standard: UL; Reliability: COMMERCIAL; Supplier: Mouser; Supplier Part Number: 200-SMH10502LS; Manufacturer Part Number: SMH-105-02-L-S; RoHS: Yes; Category: Connectors; Stock: 103; Pricing: 1=2,05, 10=2,05, 50=2,05, 100=1,59, 1000=1,09, 10000=0,669 (USD); Mounting Technology: Board; Contact Material: Bronze; Contact Finish - Termination: Tin (Sn) - with Nickel (Ni) barrier; Contact Finish - Mating: GOLD (10) OVER NICKEL (50); Insulation Color: Black; Insulation Material: Polymer; Connector Type: BOARD CONNECTOR; JESD-609 Code: e3; Contact Gender: Female; Mounting Style: RIGHT ANGLE; Number Of PCB Rows: 1; Number of Rows Loaded: 1; PCB Contact Pattern: RECTANGULAR; Termination: SMD/SMT; Body/Shell Style: SOCKET; Mixed Contacts: No; Mating Contact Pitch: 0.1inch; Mounting Option 1: LOCKING; Terminal Pitch: 2.54mm; Reach SVHC Compliant: Yes; RoHS Compliant: Yes; DIN Conformance: No; IEC Conformance: No; MIL Conformance: No; ComponentLink1URL: https://datasheet.ciiva.com:443/pdfs/VipMasterIC/IC/SAMI/SAMI-S-A0002821944/SAMI-S-A0002821944-1.pdf?src-supplier=IHS+Markit; ComponentLink1Description: https://datasheet.ciiva.com:443/pdfs/VipMasterIC/IC/SAMI/SAMI-S-A0002821944/SAMI-S-A0002821944-1.pdf?src-supplier=IHS+Markit; ComponentLink2URL: http://www.farnell.com/datasheets/1927708.pdf?_ga=2.237598468.569325269.1503285096-1413671594.1503025027&src-supplier=Farnell; ComponentLink2Description: http://www.farnell.com/datasheets/1927708.pdf?_ga=2.237598468.569325269.1503285096-1413671594.1503025027&src-supplier=Farnell; ComponentLink3URL: http://www.samtec.com/documents/webfiles/pdf/SMH.PDF?src-supplier=Newark; ComponentLink3Description: http://www.samtec.com/documents/webfiles/pdf/SMH.PDF?src-supplier=Newark; ComponentLink4URL: http://www.samtec.com/documents/webfiles/pdf/SMH.PDF?src-supplier=Avnet; ComponentLink4Description: http://www.samtec.com/documents/webfiles/pdf/SMH.PDF?src-supplier=Avnet; ComponentLink5URL: http://suddendocs.samtec.com/catalog_english/smh.pdf?src-supplier=Digikey; ComponentLink5Description: http://suddendocs.samtec.com/catalog_english/smh.pdf?src-supplier=Digikey
J7 = 64800611622_CONN_6PIN: WR-WTB Wire-to-Board Connectors 1.50 mm(ANA KARTTAN SENSOR KARTA); Manufacturer: Wurth Electronics; Supplier: Farnell; Supplier Part Number: 3818179; Manufacturer Part Number: 64800611622; RoHS: No; Category: Uncategorized; Stock: 148; Pricing: 10=0,375, 100=0,297, 500=0,262, 1000=0,257, 2500=0,252 (EUR)
L1 = IND 47uH: General Purpose Inductor, 47uH, 20%, 1 Element, Iron Alloy-Core, SMD, 1212; Manufacturer: Wurth Electronics; Supplier: Mouser; Supplier Part Number: 710-78438335470; Manufacturer Part Number: 78438335470; RoHS: Yes; Category: Fixed Inductors; Stock: 844; Pricing: 1=1,9, 10=1,9, 50=1,78, 100=1,78, 1000=1,39, 10000=1,23 (USD); Inductor Type: GENERAL PURPOSE INDUCTOR; Reach SVHC Compliant: Yes; RoHS Compliant: No; ComponentLink1URL: https://datasheet.ciiva.com:443/pdfs/VipMasterIC/IC/MIDC/MIDC-S-A0004708317/MIDC-S-A0004708317-1.pdf?src-supplier=IHS+Markit; ComponentLink1Description: https://datasheet.ciiva.com:443/pdfs/VipMasterIC/IC/MIDC/MIDC-S-A0004708317/MIDC-S-A0004708317-1.pdf?src-supplier=IHS+Markit; ComponentLink2URL: https://media.digikey.com/pdf/Data%20Sheets/Wurth%20Electronics%20PDFs/Q+_Products_Flyer.pdf?src-supplier=Digikey; ComponentLink2Description: https://media.digikey.com/pdf/Data%20Sheets/Wurth%20Electronics%20PDFs/Q+_Products_Flyer.pdf?src-supplier=Digikey
Q1 Q2 = MMBT3904-7-F: Small Signal Bipolar Transistor, 0.2A I(C), 40V V(BR)CEO, 1-Element, NPN, Silicon SOT-23F (DAHA ÖNCEDEN footprinti VARDI).; Manufacturer: Diodes Zetex; Package Body Material: Plastic; Additional Feature: HIGH RELIABILITY; Max Collector Current: 200mA; DC Current Gain-Min (hFE): 30; Number of Elements: 1; Power Dissipation-Max (Abs): 300mW; Time @ Peak Reflow Temperature-Max (s): 40s; Transistor Application: SWITCHING; Frequency: 300MHz; Turn-off Time-Max (toff): 250ns; Turn-on Time-Max (ton): 70ns; Qualification Status: Not Qualified; DESIGNED BY: MFY; Supplier: Mouser; Supplier Part Number: 621-MMBT3904-F; Manufacturer Part Number: MMBT3904-7-F; RoHS: Yes; Category: BJTs; Stock: 1405536; Pricing: 1=0,11, 10=0,052, 50=0,052, 100=0,036, 1000=0,025, 10000=0,016 (USD); Pins: 3; Package Shape: Rectangular; Terminal Finish: Tin; Transistor Element Material: SILICON; Max Operating Temperature: 150°C; JESD-609 Code: e3; Polarity/Channel Type: NPN; Collector-emitter Voltage-Max: 40V; JESD-30 Code: R-PDSO-G3; Moisture Sensitivity Level: 1; Package Style: SMALL OUTLINEMeter; Peak Reflow Temperature (Cel): 260°C; Surface Mount: Yes; Terminal Form: Gull Wing; Terminal Position: DUAL; Reach SVHC Compliant: Yes; RoHS Compliant: Yes; ComponentLink1URL: https://datasheet.ciiva.com:443/pdfs/VipMasterIC/IC/DIOD/DIOD-S-A0003133141/DIOD-S-A0003133141-1.pdf?src-supplier=IHS+Markit; ComponentLink1Description: https://datasheet.ciiva.com:443/pdfs/VipMasterIC/IC/DIOD/DIOD-S-A0003133141/DIOD-S-A0003133141-1.pdf?src-supplier=IHS+Markit; ComponentLink2URL: https://datasheet.ciiva.com/11201/ds30036-11201778.pdf?src-supplier=Avnet; ComponentLink2Description: https://datasheet.ciiva.com/11201/ds30036-11201778.pdf?src-supplier=Avnet; ComponentLink3URL: https://datasheet.ciiva.com/15138/getdatasheetpartid-53265-15138780.pdf?src-supplier=Verical; ComponentLink3Description: https://datasheet.ciiva.com/15138/getdatasheetpartid-53265-15138780.pdf?src-supplier=Verical; ComponentLink4URL: https://datasheet.ciiva.com/22711/1915516-22711750.pdf?src-supplier=Element14; ComponentLink4Description: https://datasheet.ciiva.com/22711/1915516-22711750.pdf?src-supplier=Element14; ComponentLink5URL: https://datasheet.ciiva.com/11198/ds30036-11198999.pdf?src-supplier=Avnet; ComponentLink5Description: https://datasheet.ciiva.com/11198/ds30036-11198999.pdf?src-supplier=Avnet; ComponentLink6URL: https://datasheet.ciiva.com/6361/ds30036-6361256.pdf?src-supplier=Digikey; ComponentLink6Description: https://datasheet.ciiva.com/6361/ds30036-6361256.pdf?src-supplier=Digikey; ComponentLink7URL: https://datasheet.ciiva.com/6361/ds30036-6361254.pdf?src-supplier=Digikey; ComponentLink7Description: https://datasheet.ciiva.com/6361/ds30036-6361254.pdf?src-supplier=Digikey
R1 = 5WD27: Fixed Resistor, Wire Wound, 5W, 0.27ohm, 200V, 5% +/-Tol, 300ppm/Cel, 8738; Manufacturer: NTE Electronics; DESIGNED BY: MFY; Temperature Coefficient (ppm/Cel): 300; Lead Diameter: 0.8mm; Lead Length: 38.1mm; Package Height: 9.65mm; Package Length: 22mm; Supplier: Digikey; Supplier Part Number: 2368-5WD27-ND; Manufacturer Part Number: 5WD27; RoHS: Yes; Category: Through-Hole Resistors; Pins: 2; Case/Package: 8738; Tolerance: 5%; Resistor Type: FIXED RESISTOR; Technology: WIRE WOUND; Construction: Wirewound; Package Style: AXIAL; Power: 5W; Working Voltage: 200V; Package Width: 9.65mm; RoHS Compliant: Yes; ComponentLink1URL: https://datasheet.ciiva.com:443/pdfs/VipMasterIC/IC/NTEE/NTEE-S-A0004025222/NTEE-S-A0004025222-1.pdf?src-supplier=IHS+Markit; ComponentLink1Description: https://datasheet.ciiva.com:443/pdfs/VipMasterIC/IC/NTEE/NTEE-S-A0004025222/NTEE-S-A0004025222-1.pdf?src-supplier=IHS+Markit; ComponentLink2URL: https://datasheet.ciiva.com/15772/fivewire-15772442.pdf?src-supplier=Onlinecomponents.com; ComponentLink2Description: https://datasheet.ciiva.com/15772/fivewire-15772442.pdf?src-supplier=Onlinecomponents.com
R3 R5 = RES 10K OHM 0603: RES 10K %1 OHM 0603 SMD; Manufacturer: Yageo Group; DESIGNED BY: MFY; Supplier: Farnell; Supplier Part Number: 9238603; Manufacturer Part Number: RC0603FR-0710KL; RoHS: No; Category: Chip SMD Resistors; Stock: 451311; Pricing: 10=0,0085, 100=0,0066, 500=0,0063, 1000=0,0047, 2500=0,0037 (EUR); ComponentLink1URL: https://datasheet.octopart.com/RC0603FR-0710KL-Yageo-datasheet-62067350.pdf?src-supplier=Element14; ComponentLink1Description: https://datasheet.octopart.com/RC0603FR-0710KL-Yageo-datasheet-62067350.pdf?src-supplier=Element14; ComponentLink2URL: https://datasheet.octopart.com/RC0603FR-0710KL-Yageo-datasheet-15599030.pdf?src-supplier=Future+Electronics; ComponentLink2Description: https://datasheet.octopart.com/RC0603FR-0710KL-Yageo-datasheet-15599030.pdf?src-supplier=Future+Electronics; ComponentLink3URL: https://datasheet.octopart.com/RC0603FR-0710KL-Yageo-datasheet-118562.pdf?src-supplier=Digikey; ComponentLink3Description: https://datasheet.octopart.com/RC0603FR-0710KL-Yageo-datasheet-118562.pdf?src-supplier=Digikey; ComponentLink4URL: https://datasheet.octopart.com/RC0603FR-0710KL-Yageo-datasheet-12596169.pdf?src-supplier=Newark; ComponentLink4Description: https://datasheet.octopart.com/RC0603FR-0710KL-Yageo-datasheet-12596169.pdf?src-supplier=Newark; ComponentLink5URL: https://datasheet.octopart.com/RC0603FR-0710KL-Yageo-datasheet-8328172.pdf?src-supplier=Farnell; ComponentLink5Description: https://datasheet.octopart.com/RC0603FR-0710KL-Yageo-datasheet-8328172.pdf?src-supplier=Farnell; Case/Package: 0603
RL1 RL2 = ALQ112: General Purpose Relay SPDT (1 Form C) 12VDC Coil Through Hole; Manufacturer: Panasonic; End Contact Material: Silver; Coil Current(DC)-Max: 33mA; Coil Operate Voltage(DC): 9V; Coil Power: 400mW; Coil Release Voltage(DC): 600mV; Coil Resistance: 360R; Coil Voltage(DC)-Max: 12V; Coil/Input Supply Type: DC; Contact AC Max Power Rating R Load: 1250VA@250VAC; Contact AC Max Rating R Load: 10A@125VAC; Contact Current(AC)-Max: 10A; Contact Current(DC)-Max: 5A; Contact DC Max Power Rating R Load: 150W@30VDC; Contact DC Max Rating R Load: 5A@30VDC; Contact Resistance: 100mR; Contact Voltage(AC)-Max: 125V; Contact Voltage(DC)-Max: 30V; Contact/Output Supply Type: AC/DC; Dielectric Strength Between Coil and Contacts: 4000Vrms; Dielectric Strength Between Open Contacts: 750Vrms; Input Switching Control Type: Random; Insulation Resistance: 1GR; Operate Time: 20ms; PCB Hole Count: 5; Relay Action: MOMENTARY; Relay Form: 1 FORM C; Relay Type: POWER/SIGNAL RELAY; Body Breadth: 10mm; Body Height: 16mm; Body Length or Diameter: 20mm; Reference Standard: UL; Sealing: MOISTURE PROOF; Supplier: Future Electronics; Supplier Part Number: 5061407; Manufacturer Part Number: ALQ112; RoHS: Yes; Category: Power Relays; Stock: 4000; Pricing: 100=0,56, 400=0,545, 1500=0,53, 4000=0,525, 10000=0,51 (USD); Mounting Technology: Through Hole; Pins: 5; Weight: 7g; Min Operating Temperature: -40°C; Max Operating Temperature: 85°C; Coil Voltage-Nom: 12V; Packaging: Box; Relay Function: SPDT; Release Time: 20ms; Termination: Solder; Terminal Length: 0.0042inch; RoHS Compliant: Yes; ComponentLink1URL: https://datasheet.ciiva.com:443/pdfs/VipMasterIC/IC/PANA/PANA-S-A0003568054/PANA-S-A0003568054-1.pdf?src-supplier=IHS+Markit; ComponentLink1Description: https://datasheet.ciiva.com:443/pdfs/VipMasterIC/IC/PANA/PANA-S-A0003568054/PANA-S-A0003568054-1.pdf?src-supplier=IHS+Markit; ComponentLink2URL: https://datasheet.ciiva.com/24388/307ds-61b20-en-lq-24388909.pdf?src-supplier=Onlinecomponents.com; ComponentLink2Description: https://datasheet.ciiva.com/24388/307ds-61b20-en-lq-24388909.pdf?src-supplier=Onlinecomponents.com; Case/Package: ALQ112
T1 = BV302S12010-ZU: Split Bobbin Power Transformer, 230-12V 1VA; Manufacturer: Zettler Magnetics; DESIGNED BY: MFY; Primary Voltage: 230 V; Secondary Voltage: 12V; Operating Frequency: 50-60 Hz; Supplier: Future Electronics; Supplier Part Number: 9036725; Manufacturer Part Number: BV302S12010; RoHS: No; Category: Uncategorized; Pricing: 15=1,58, 60=1,56, 225=1,53, 375=1,52, 750=1,49 (USD); Reach SVHC Compliant: No; RoHS Compliant: No
U1 = LM2675MX-12/NOPB: Switching Regulator, Voltage-mode, 2.2A, 275kHz Switching Freq-Max, DMOS, PDSO8; Manufacturer: TI National Semiconductor; Package Body Material: Plastic; Control Technique: PULSE WIDTH MODULATION; Max Supply Voltage: 40V; Min Input Voltage: 6.5V; Nominal Supply Voltage: 24V; Channels: 1; Nominal Output Voltage: 12V; Switcher Configuration: BUCK; Time @ Peak Reflow Temperature-Max (s): 40s; Qualification Status: Not Qualified; DESIGNED BY: MFY; Supplier: Mouser; Supplier Part Number: 926-LM2675MX-12/NOPB; Manufacturer Part Number: LM2675MX-12/NOPB; RoHS: Yes; Category: Voltage Regulators - Switching; Stock: 1434; Pricing: 1=4,82, 10=3,66, 50=3,37, 100=3,05, 1000=2,73, 10000=2,65 (USD); Case/Package: SOIC; Pins: 8; Package Shape: Rectangular; Terminal Finish: Tin; Min Operating Temperature: -40°C; Max Operating Temperature: 125°C; JESD-609 Code: e3; Throw Configuration: SWITCHING REGULATOR; Control Mode: VOLTAGE-MODE; JESD-30 Code: R-PDSO-G8; Moisture Sensitivity Level: 1; Max Output current: 2.2A; Package Style: SMALL OUTLINEMeter; Peak Reflow Temperature (Cel): 260°C; Surface Mount: Yes; Frequency: 275kHz; Technology: DMOS; Terminal Form: Gull Wing; Terminal Position: DUAL; Length: 4.9mm; Width: 3.9mm; Height - Seated (Max): 1.75mm; Terminal Pitch: 1.27mm; Temperature Grade: AUTOMOTIVE; Reach SVHC Compliant: Yes; RoHS Compliant: Yes; ComponentLink1URL: https://datasheet.ciiva.com:443/pdfs/VipMasterIC/IC/TXII/TXIIS100070/TXIIS168554-1.pdf?src-supplier=IHS+Markit; ComponentLink1Description: https://datasheet.ciiva.com:443/pdfs/VipMasterIC/IC/TXII/TXIIS100070/TXIIS168554-1.pdf?src-supplier=IHS+Markit; ComponentLink2URL: https://datasheet.ciiva.com/41457/001013881-da-01-en-ic-reg-buck-lm2675mx-12-nopb-soic-8-tid-41457896.pdf?src-supplier=Conrad; ComponentLink2Description: https://datasheet.ciiva.com/41457/001013881-da-01-en-ic-reg-buck-lm2675mx-12-nopb-soic-8-tid-41457896.pdf?src-supplier=Conrad; ComponentLink3URL: https://datasheet.ciiva.com/3220/lm2675-3220840.pdf?src-supplier=Avnet; ComponentLink3Description: https://datasheet.ciiva.com/3220/lm2675-3220840.pdf?src-supplier=Avnet
U2 = AP7361-33E-13: Fixed Positive LDO Regulator, 3.3V, 0.7V Dropout, CMOS, PSSO3,SOT-223; Manufacturer: Diodes; Package Body Material: Plastic; Dropout Voltage1-Max: 700mV; Dropout Voltage1-Nom: 500mV; Input Voltage Absolute-Max: 6.5V; Max Supply Voltage: 6V; Min Input Voltage: 4.3V; Channels: 1; Output Current1-Max: 1A; Output Voltage1-Max: 3.399V; Output Voltage1-Min: 3.201V; Regulator Type: FIXED POSITIVE SINGLE OUTPUT LDO REGULATOR; Time @ Peak Reflow Temperature-Max (s): 30s; Voltage Tolerance-Max: 6.5%; Qualification Status: Not Qualified; DESIGNED BY: MFY; Supplier: Mouser; Supplier Part Number: 621-AP7361-33E-13; Manufacturer Part Number: AP7361-33E-13; RoHS: Yes; Category: Voltage Regulators - Linear; Stock: 22552; Pricing: 1=0,31, 10=0,212, 50=0,188, 100=0,146, 1000=0,136, 10000=0,135 (USD); Pins: 3; Package Shape: Rectangular; Terminal Finish: Tin; JESD-609 Code: e3; Adjustability: FIXED; Moisture Sensitivity Level: 1; Number of Outputs: 1; Operating Temperature, TJ-Max: 150°C; Operating Temperature, TJ-Min: -40°C; Output Voltage1-Nom: 3.3V; Packaging: Tape and Reel; Peak Reflow Temperature (Cel): 260°C; Surface Mount: Yes; Technology: CMOS; Terminal Form: Gull Wing; Terminal Position: SINGLE; Length: 6.5mm; Width: 3.5mm; Height - Seated (Max): 1.8mm; Terminal Pitch: 2.3mm; Reach SVHC Compliant: Yes; RoHS Compliant: Yes; ComponentLink1URL: https://datasheet.ciiva.com:443/pdfs/VipMasterIC/IC/DIOD/DIOD-S-A0002906110/DIOD-S-A0002906110-1.pdf?src-supplier=IHS+Markit; ComponentLink1Description: https://datasheet.ciiva.com:443/pdfs/VipMasterIC/IC/DIOD/DIOD-S-A0002906110/DIOD-S-A0002906110-1.pdf?src-supplier=IHS+Markit; ComponentLink2URL: https://datasheet.ciiva.com/26926/getdatasheetpartid-670786-26926141.pdf?src-supplier=Verical; ComponentLink2Description: https://datasheet.ciiva.com/26926/getdatasheetpartid-670786-26926141.pdf?src-supplier=Verical; ComponentLink3URL: https://datasheet.ciiva.com/25651/ap7361-25651049.pdf?src-supplier=Digikey; ComponentLink3Description: https://datasheet.ciiva.com/25651/ap7361-25651049.pdf?src-supplier=Digikey; Case/Package: SOT-223
USB1 = Micro B USB Connector: CONN USB MICRO B RECPT SMT R/A; Manufacturer: Amphenol ICC / FCI; Supplier: Mouser; Supplier Part Number: 649-10118192-0001LF; Manufacturer Part Number: 10118192-0001LF; RoHS: No; Category: Uncategorized; Stock: 18597; Pricing: 1=0,43, 10=0,367, 50=0,328, 100=0,312, 1000=0,279, 10000=0,216 (USD)